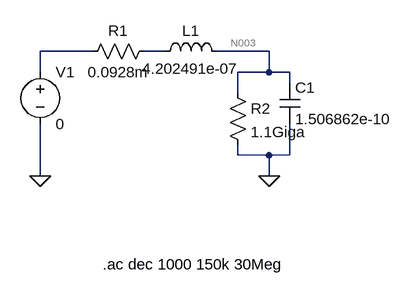
[diagram p0: schematic 2m_cable_model.asc]
2m_cable_model.asc, the LTspice schematic file:
Version 4
SHEET 1 1036 680
WIRE 288 224 208 224
WIRE 400 224 368 224
WIRE 560 224 480 224
WIRE 208 256 208 224
WIRE 560 256 560 224
WIRE 560 256 512 256
WIRE 592 256 560 256
WIRE 592 272 592 256
WIRE 512 288 512 256
WIRE 512 384 512 368
WIRE 560 384 512 384
WIRE 592 384 592 336
WIRE 592 384 560 384
WIRE 208 416 208 336
WIRE 560 416 560 384
FLAG 560 416 0
FLAG 208 416 0
SYMBOL cap 576 272 R0
SYMATTR InstName C1
SYMATTR Value 1.506862e-10
SYMBOL ind 384 240 R270
WINDOW 0 32 56 VTop 2
WINDOW 3 5 56 VBottom 2
SYMATTR InstName L1
SYMATTR Value 4.202491e-07
SYMBOL res 384 208 R90
WINDOW 0 0 56 VBottom 2
WINDOW 3 32 56 VTop 2
SYMATTR InstName R1
SYMATTR Value 0.0928m
SYMBOL voltage 208 240 R0
SYMATTR InstName V1
SYMATTR Value 0
SYMATTR Value2 AC 1 0
SYMATTR SpiceLine Rser=0 Cpar=0
SYMBOL res 496 272 R0
SYMATTR InstName R2
SYMATTR Value 1.1Giga
TEXT 304 552 Left 2 !.ac dec 1000 150k 30Meg

The netlist it stands for:
* 2m_cable_model.asc
C1 N003 0 1.506862e-10
L1 N002 N003 4.202491e-07
R1 N002 N001 0.0928m
V1 N001 0 0 AC 1 0 Rser=0 Cpar=0
R2 N003 0 1.1Giga
.ac dec 1000 150k 30Meg
.backanno
.end

* Results of the author's LTspice run, read from the files saved beside the schematic
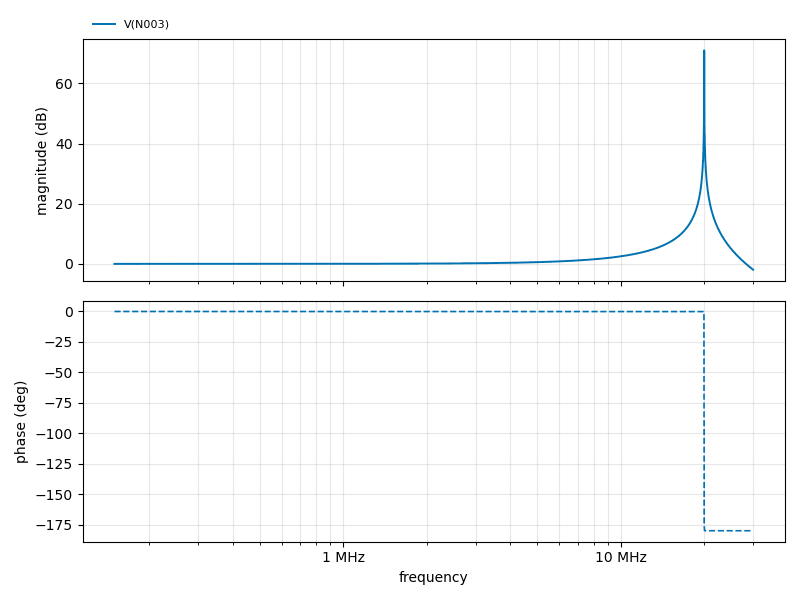
[diagram p1: AC Analysis of 2m_cable_model.asc, plotted from the saved traces]
* AC Analysis, 1 run:
*   V(N003): 0.00 dB at 150 kHz, -1.94 dB at 30 MHz, peak 70.97 dB at 20 MHz, 3 dB below the peak at 20 MHz and 20.01 MHz